# EAGLE design tinyarray2 (EAGLE 9.4.1)
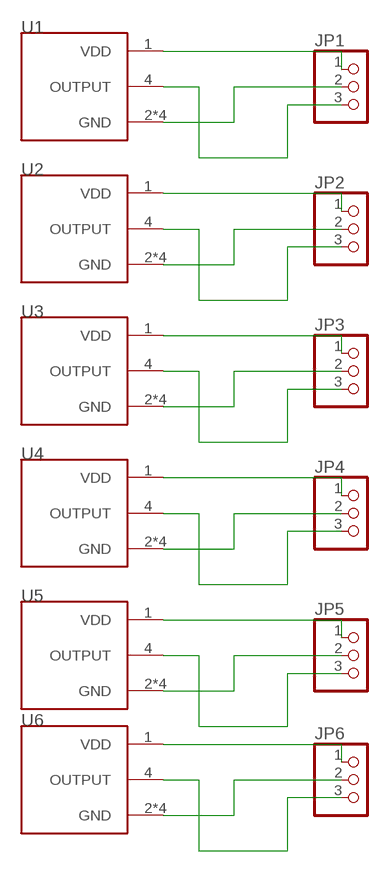
[diagram p0: schematic, sheet 1]

## Parts
JP1  PINHD-1X3  [1X03]
JP2  PINHD-1X3  [1X03]
JP3  PINHD-1X3  [1X03]
JP4  PINHD-1X3  [1X03]
JP5  PINHD-1X3  [1X03]
JP6  PINHD-1X3  [1X03]
U1  CMM-3729AB-38116-TR  [XDCR_CMM-3729AB-38116-TR]
U2  CMM-3729AB-38116-TR  [XDCR_CMM-3729AB-38116-TR]
U3  CMM-3729AB-38116-TR  [XDCR_CMM-3729AB-38116-TR]
U4  CMM-3729AB-38116-TR  [XDCR_CMM-3729AB-38116-TR]
U5  CMM-3729AB-38116-TR  [XDCR_CMM-3729AB-38116-TR]
U6  CMM-3729AB-38116-TR  [XDCR_CMM-3729AB-38116-TR]

## Nets
N$1: JP1.2 U1.2(GND) U1.3(GND) U1.5(GND) U1.6(GND)
N$2: JP1.1 U1.1(VDD)
N$3: JP1.3 U1.4(OUTPUT)
N$4: JP2.2 U2.2(GND) U2.3(GND) U2.5(GND) U2.6(GND)
N$5: JP2.1 U2.1(VDD)
N$6: JP2.3 U2.4(OUTPUT)
N$7: JP3.2 U3.2(GND) U3.3(GND) U3.5(GND) U3.6(GND)
N$8: JP3.1 U3.1(VDD)
N$9: JP3.3 U3.4(OUTPUT)
N$10: JP4.2 U4.2(GND) U4.3(GND) U4.5(GND) U4.6(GND)
N$11: JP4.1 U4.1(VDD)
N$12: JP4.3 U4.4(OUTPUT)
N$13: JP5.2 U5.2(GND) U5.3(GND) U5.5(GND) U5.6(GND)
N$14: JP5.1 U5.1(VDD)
N$15: JP5.3 U5.4(OUTPUT)
N$16: JP6.2 U6.2(GND) U6.3(GND) U6.5(GND) U6.6(GND)
N$17: JP6.1 U6.1(VDD)
N$18: JP6.3 U6.4(OUTPUT)

## Library data of the parts
JP1-JP6 = adafruit:PINHD-1X3: PIN HEADER
U1-U6 = CMM-3729AB-38116-TR:CMM-3729AB-38116-TR; MANUFACTURER: CUI Inc; STANDARD: Manufacturer Recommendations

## Board
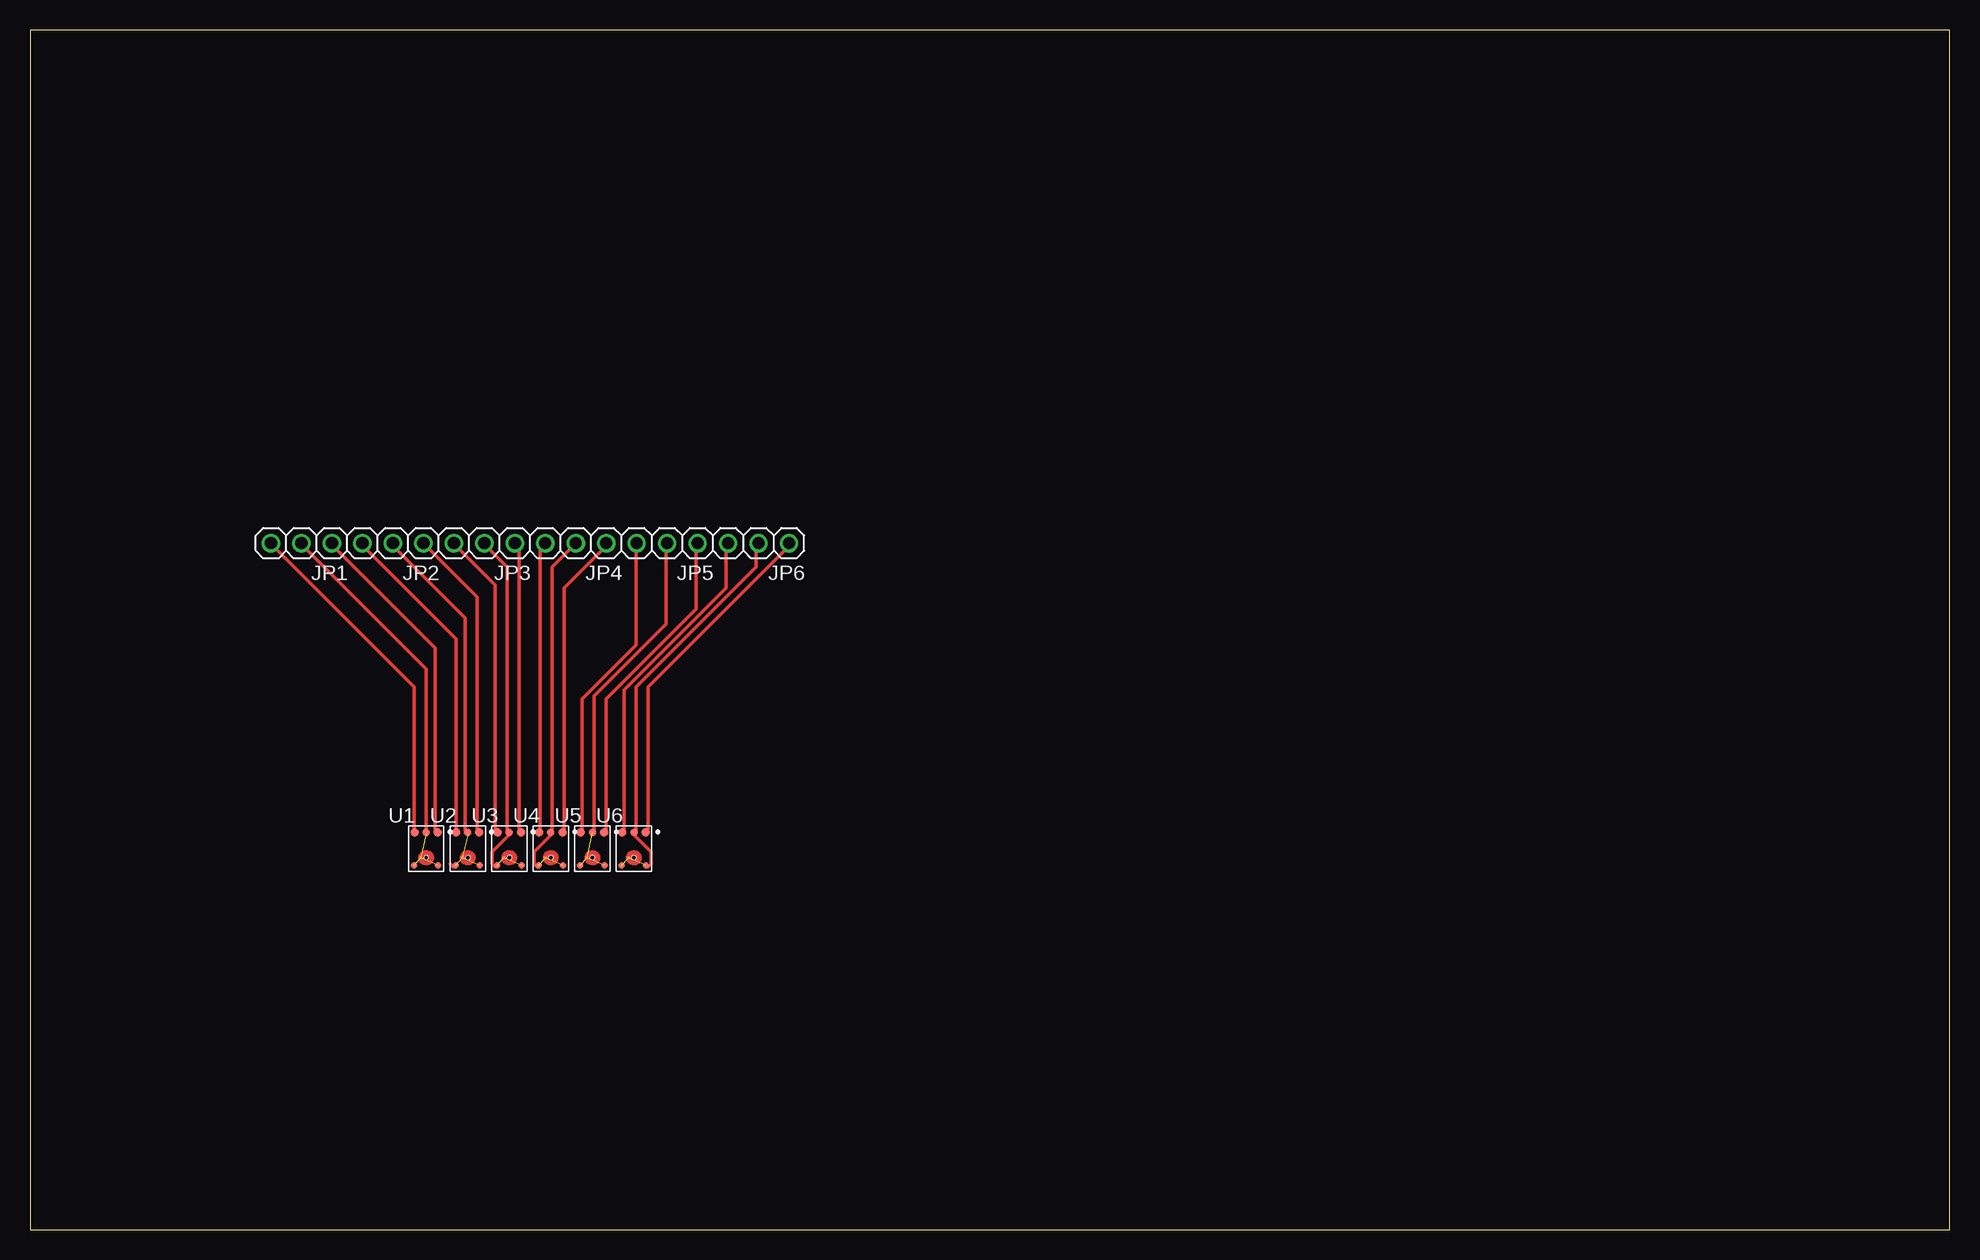
[diagram p1: board, top side]

Size 160 x 100 mm. Coordinates in mm from the lower left corner, seen from the top.
Outline: 0,0 160,0 160,100 0,100 0,0
Copper layers (1*16): Top 0.035mm / dielectric 1.5mm / Bottom 0.035mm
Design rules "default *": minimum track width 0.3mm, minimum drill 0.35mm, track to track 0.2mm, track to pad 6mil, pad to pad 6mil, via to via 6mil, smd to smd 6mil, copper to edge 40mil, drill to drill 6mil, minimum pad ring 10mil, minimum via ring 8mil, stop-mask expansion 4mil, vias tented up to drill 0mil, thermal gap 10mil

### Footprints (pad centres in the part's own frame; a part is rotated, then mirrored left to right if it is on the bottom)
1X03 = drill 1.016: 1 -2.54,0; 2 0,0; 3 2.54,0
XDCR_CMM-3729AB-38116-TR = smd 0.72 x 0.72: 1 0.97,1.34; 4 -0.97,1.34 | smd 0.56 x 0.56: 2 1.015,-1.39; 3 -1.015,-1.39 | smd 0.61 x 0.61: 5 0,1.34 | smd 0.2 x 0.2: 6 -0.45,-0.75 | hole 0.35: 0,-0.76

### Placement (x,y rotation side)
JP1  22.63,57.22 180 top
JP2  30.25,57.22 180 top
JP3  37.87,57.22 180 top
JP4  45.49,57.22 180 top
JP5  53.11,57.22 180 top
JP6  60.73,57.22 180 top
U1  33.02,31.75 0 top
U2  36.48,31.75 0 top
U3  39.95,31.75 0 top
U4  43.41,31.75 0 top
U5  46.88,31.75 0 top
U6  50.34,31.75 0 top

### Tracks (layer width: path | path; a pad name or v marks a point on that pad's centre or on a via)
N$1  (3 unrouted)
  Top 0.3: 33,33 U1.5 33,33.25 33,46.75 22.75,57 JP1.2
N$2
  Top 0.3: U1.1 33.75,33.25 33.75,48.5 25.25,57 JP1.1
N$3
  Top 0.3: U1.4 32,33.25 32,45.25 20.25,57 JP1.3
N$4  (3 unrouted)
  Top 0.3: 35,30.5 35.25,30.25 U2.3 | 36.5,33 U2.5 36.25,33.25 36.25,51 30.25,57 JP2.2
N$5
  Top 0.3: U2.1 37.25,33.25 37.25,52.75 33,57 JP2.1
N$6
  Top 0.3: U2.4 35.5,33.25 35.5,49.25 27.75,57 JP2.3
N$7  (2 unrouted)
  Top 0.3: U3.3 38.75,30.25 38.5,30.5 38.5,31.5 40,33 U3.5 39.75,33.25 39.75,55.25 38,57 JP3.2
N$8
  Top 0.3: U3.1 40.75,33.25 40.75,56.75 40.5,57 JP3.1
N$9
  Top 0.3: U3.4 38.75,33.25 38.75,53.75 35.5,57 JP3.3
N$10  (2 unrouted)
  Top 0.3: U4.3 42.25,30.25 42,30.5 42,31.5 43.5,33 U4.5 43.5,33.25 43.5,55.25 45.25,57 JP4.2
N$11
  Top 0.3: U4.1 44.5,33.25 44.5,53.5 48,57 JP4.1
N$12
  Top 0.3: U4.4 42.5,33.25 42.5,56.75 42.75,57 JP4.3
N$13  (3 unrouted)
  Top 0.3: U5.5 47,33.25 47,44.5 53,50.5 53,57 JP5.2
N$14
  Top 0.3: U5.1 48,33.25 48,44.25 55.5,51.75 55.5,57 JP5.1
N$15
  Top 0.3: U5.4 46,33.25 46,44.25 50.5,48.75 50.5,57 JP5.3
N$16  (2 unrouted)
  Top 0.3: U6.2 51.5,30.25 51.75,30.5 51.75,31.5 50.25,33 U6.5 50.5,33.25 50.5,45.25 60.5,55.25 60.5,57 JP6.2
N$17
  Top 0.3: U6.1 51.5,33.25 51.5,45.25 63.25,57 JP6.1
N$18
  Top 0.3: U6.4 49.5,33.25 49.5,45 58,53.5 58,57 JP6.3